# EAGLE design mini-v1.13-macrofab-rtg (EAGLE 7.2.0)

## Sheet 1 of 4: Main Microcontroller
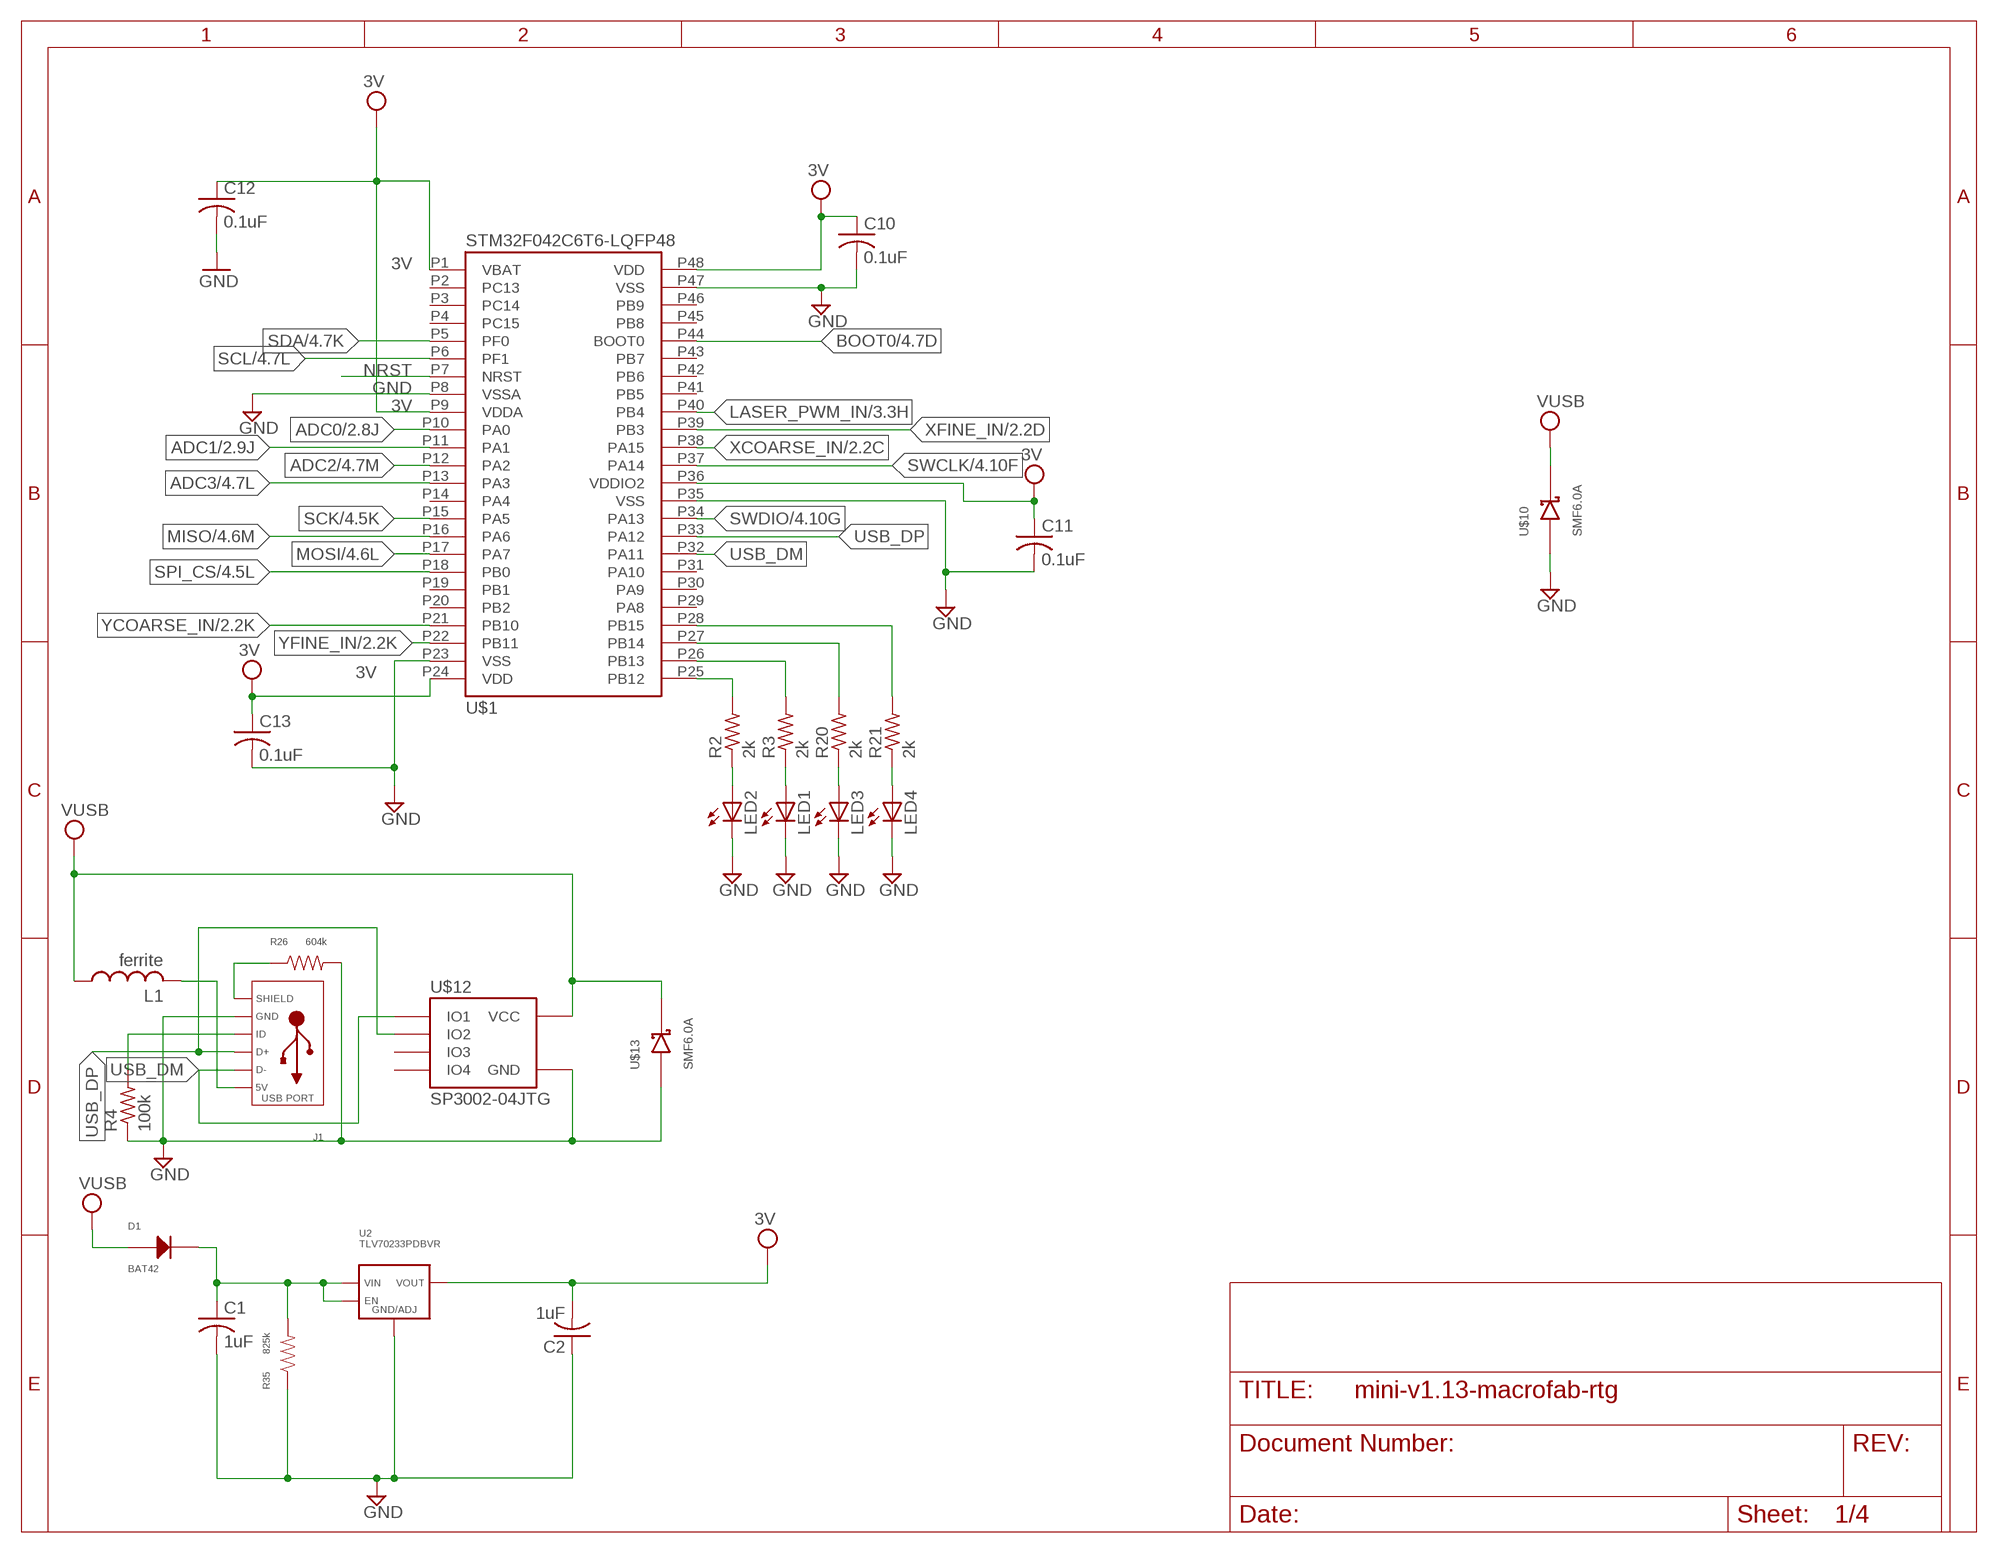
[diagram p0: schematic, sheet 1]

### Parts
C1  1uF  C-USC0603  [C0603]
C2  1uF  C-USC0603  [C0603]
C10  0.1uF  C-USC0603  [C0603]
C11  0.1uF  C-USC0603  [C0603]
C12  0.1uF  C-USC0603  [C0603]
C13  0.1uF  C-USC0603  [C0603]
D1  BAT42  DIODE_SOD-123  [SOD-123]
J1  USB_MICRO_RIGHT  [MICROUSB-RIGHT]
L1  ferrite  L-US  [C0603]
LED1  LEDCHIP-LED0603  [CHIP-LED0603]
LED2  LEDCHIP-LED0603  [CHIP-LED0603]
LED3  LEDCHIP-LED0603  [CHIP-LED0603]
LED4  LEDCHIP-LED0603  [CHIP-LED0603]
R2  2k  R-US_R0603  [R0603]
R3  2k  R-US_R0603  [R0603]
R4  100k  R-US_R0603  [R0603]
R20  2k  R-US_R0603  [R0603]
R21  2k  R-US_R0603  [R0603]
R26  604k  RESISTOR_0603  [R0603]
R35  825k  RESISTOR_0603  [R0603]
U2  TLV70233PDBVR  [SOT-23-5]
U$1  STM32F042C6T6-LQFP48  STM32F042-LQFP48  [LQFP48]
U$10  SMF6.0A  MBR0520  [SOD123]
U$12  SP3002-04JTG  SP3002  [SC70-6]
U$13  SMF6.0A  MBR0520  [SOD123]

### Nets
3V: C2.2 C10.1 C11.1 C12.1 C13.1 U2.P$5(VOUT) U$1.P1(VBAT) U$1.P9(VDDA) U$1.P24(VDD) U$1.P36(VDDIO2) U$1.P48(VDD) ; also sheet 2,4
ADC0: U$1.P10(PA0) ; also sheet 2
ADC1: U$1.P11(PA1) ; also sheet 2
ADC2: U$1.P12(PA2) ; also sheet 4
ADC3: U$1.P13(PA3) ; also sheet 4
BOOT0: U$1.P44(BOOT0) ; also sheet 4
GND [Power]: C1.2 C2.1 C10.2 C11.2 C12.2 C13.2 J1.5(GND) LED1.C LED2.C LED3.C LED4.C R4.1 R26.P$2 R35.P$1 U2.P$2(GND/ADJ) U$1.P8(VSSA) U$1.P23(VSS) U$1.P35(VSS) U$1.P47(VSS) U$10.ANODE U$12.P2(GND) U$13.ANODE ; also sheet 2,3,4
LASER_PWM_IN: U$1.P40(PB4) ; also sheet 3
MISO: U$1.P16(PA6) ; also sheet 4
MOSI: U$1.P17(PA7) ; also sheet 4
N$2: R2.2 U$1.P25(PB12)
N$3: LED2.A R2.1
N$4: C1.1 D1.CATHODE R35.P$2 U2.P$1(VIN) U2.P$3(EN)
N$5: J1.4(ID) R4.2
N$12: LED1.A R3.1
N$13: R3.2 U$1.P26(PB13)
N$14: J1.1(5V) L1.2
N$18: J1.S1(SLD) J1.S2(SLD) J1.S3(SLD) J1.S4(SLD) J1.S5(SLD) J1.S6(SLD) R26.P$1
N$24: LED3.A R20.1
N$27: LED4.A R21.1
N$28: R20.2 U$1.P27(PB14)
N$29: R21.2 U$1.P28(PB15)
NRST: U$1.P7(NRST) ; also sheet 4
SCK: U$1.P15(PA5) ; also sheet 4
SCL: U$1.P6(PF1) ; also sheet 4
SDA: U$1.P5(PF0) ; also sheet 4
SPI_CS: U$1.P18(PB0) ; also sheet 4
SWCLK: U$1.P37(PA14) ; also sheet 4
SWDIO: U$1.P34(PA13) ; also sheet 4
USB_DM: J1.2(D-) U$1.P32(PA11) U$12.P1(IO1)
USB_DP: J1.3(D+) U$1.P33(PA12) U$12.P3(IO2)
VUSB [Power]: D1.ANODE L1.1 U$10.CATHODE U$12.P5(VCC) U$13.CATHODE ; also sheet 2,3,4
XCOARSE_IN: U$1.P38(PA15) ; also sheet 2
XFINE_IN: U$1.P39(PB3) ; also sheet 2
YCOARSE_IN: U$1.P21(PB10) ; also sheet 2
YFINE_IN: U$1.P22(PB11) ; also sheet 2
Unconnected: U$1.P2(PC13) U$1.P3(PC14) U$1.P4(PC15) U$1.P14(PA4) U$1.P19(PB1) U$1.P20(PB2) U$1.P29(PA8) U$1.P30(PA9) U$1.P31(PA10) U$1.P41(PB5) U$1.P42(PB6) U$1.P43(PB7) U$1.P45(PB8) U$1.P46(PB9) U$12.P4(IO3) U$12.P6(IO4)

## Sheet 2 of 4: Dual PWM
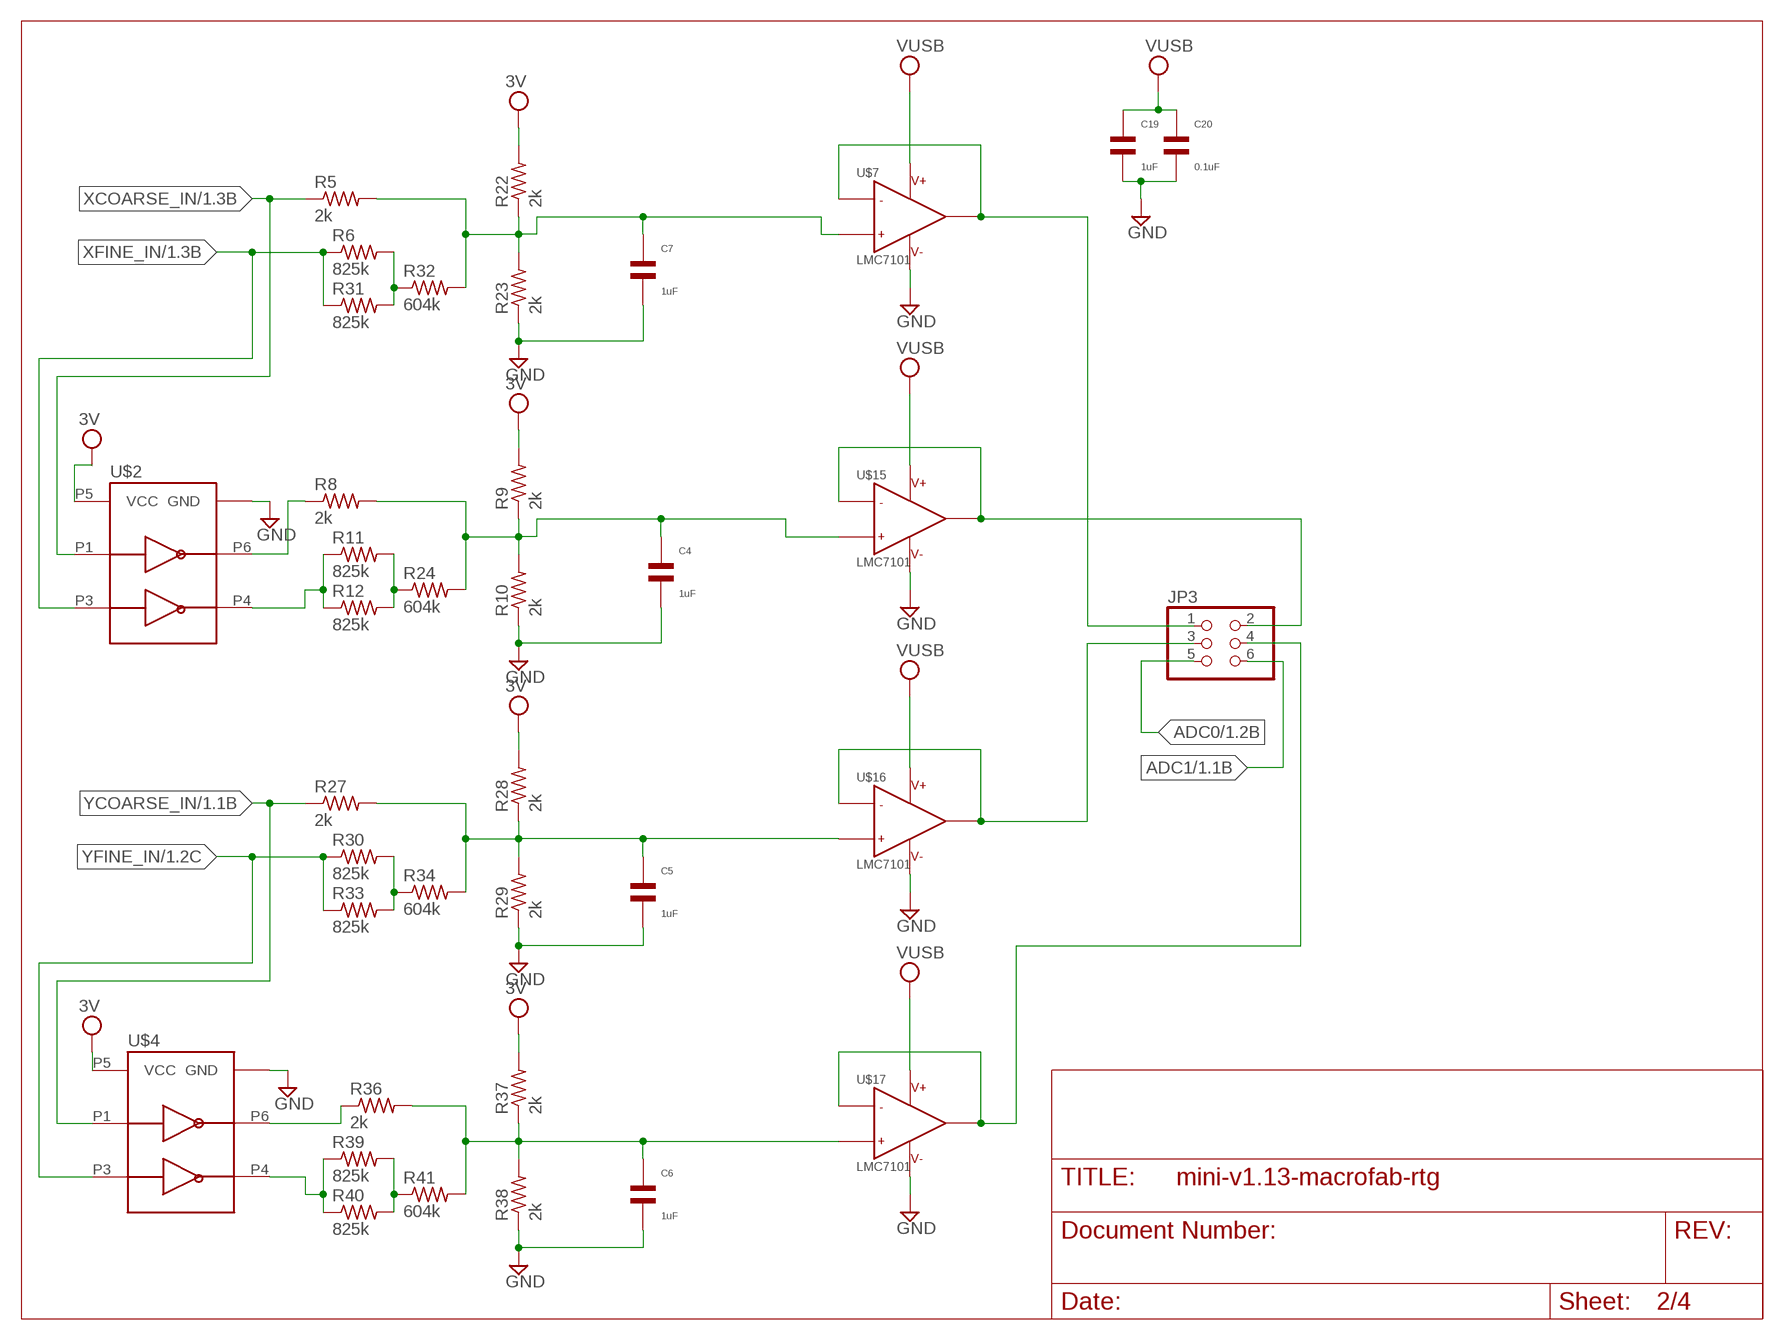
[diagram p1: schematic, sheet 2]

### Parts
C4  1uF  CAPACITOR_NP_0603  [C0603]
C5  1uF  CAPACITOR_NP_0603  [C0603]
C6  1uF  CAPACITOR_NP_0603  [C0603]
C7  1uF  CAPACITOR_NP_0603  [C0603]
C19  1uF  CAPACITOR_NP_0603  [C0603]
C20  0.1uF  CAPACITOR_NP_0603  [C0603]
JP3  PINHD-2X3  [2X03]
R5  2k  R-US_R0603  [R0603]
R6  825k  R-US_R0603  [R0603]
R8  2k  R-US_R0603  [R0603]
R9  2k  R-US_R0603  [R0603]
R10  2k  R-US_R0603  [R0603]
R11  825k  R-US_R0603  [R0603]
R12  825k  R-US_R0603  [R0603]
R22  2k  R-US_R0603  [R0603]
R23  2k  R-US_R0603  [R0603]
R24  604k  R-US_R0603  [R0603]
R27  2k  R-US_R0603  [R0603]
R28  2k  R-US_R0603  [R0603]
R29  2k  R-US_R0603  [R0603]
R30  825k  R-US_R0603  [R0603]
R31  825k  R-US_R0603  [R0603]
R32  604k  R-US_R0603  [R0603]
R33  825k  R-US_R0603  [R0603]
R34  604k  R-US_R0603  [R0603]
R36  2k  R-US_R0603  [R0603]
R37  2k  R-US_R0603  [R0603]
R38  2k  R-US_R0603  [R0603]
R39  825k  R-US_R0603  [R0603]
R40  825k  R-US_R0603  [R0603]
R41  604k  R-US_R0603  [R0603]
U$2  NC7WZ14P6X  [SC70-6]
U$4  NC7WZ14P6X  [SC70-6]
U$7  LMC7101  [SOT23-5]
U$15  LMC7101  [SOT23-5]
U$16  LMC7101  [SOT23-5]
U$17  LMC7101  [SOT23-5]

### Nets
3V: R9.2 R22.2 R28.2 R37.2 U$2.P5(VCC) U$4.P5(VCC) ; also sheet 1,4
ADC0: JP3.5 ; also sheet 1
ADC1: JP3.6 ; also sheet 1
COARSE1: R8.1 U$2.P6(Y1)
FINE1: R11.1 R12.1 U$2.P4(Y2)
FINE3: R39.1 R40.1 U$4.P4(Y2)
GND [Power]: C4.P$2 C5.P$2 C6.P$2 C7.P$2 C19.P$2 C20.P$2 R10.1 R23.1 R29.1 R38.1 U$2.P2(GND) U$4.P2(GND) U$7.5 U$15.5 U$16.5 U$17.5 ; also sheet 1,3,4
N$7: R36.1 U$4.P6(Y1)
N$8: R11.2 R12.2 R24.1
N$10: C4.P$1 R8.2 R9.1 R10.2 R24.2 U$15.3
N$30: R30.2 R33.2 R34.1
N$31: R6.2 R31.2 R32.1
N$32: C5.P$1 R27.2 R28.1 R29.2 R34.2 U$16.3
N$35: R39.2 R40.2 R41.1
N$36: C6.P$1 R36.2 R37.1 R38.2 R41.2 U$17.3
OUT: JP3.1 U$7.1 U$7.4
OUT1: JP3.2 U$15.1 U$15.4
OUT2: JP3.3 U$16.1 U$16.4
OUT3: JP3.4 U$17.1 U$17.4
VUSB [Power]: C19.P$1 C20.P$1 U$7.2 U$15.2 U$16.2 U$17.2 ; also sheet 1,3,4
XCOARSE_IN: R5.1 U$2.P1(A1) ; also sheet 1
XFINE_IN: R6.1 R31.1 U$2.P3(A2) ; also sheet 1
XSUM: C7.P$1 R5.2 R22.1 R23.2 R32.2 U$7.3
YCOARSE_IN: R27.1 U$4.P1(A1) ; also sheet 1
YFINE_IN: R30.1 R33.1 U$4.P3(A2) ; also sheet 1

## Sheet 3 of 4: Laser Power Driver
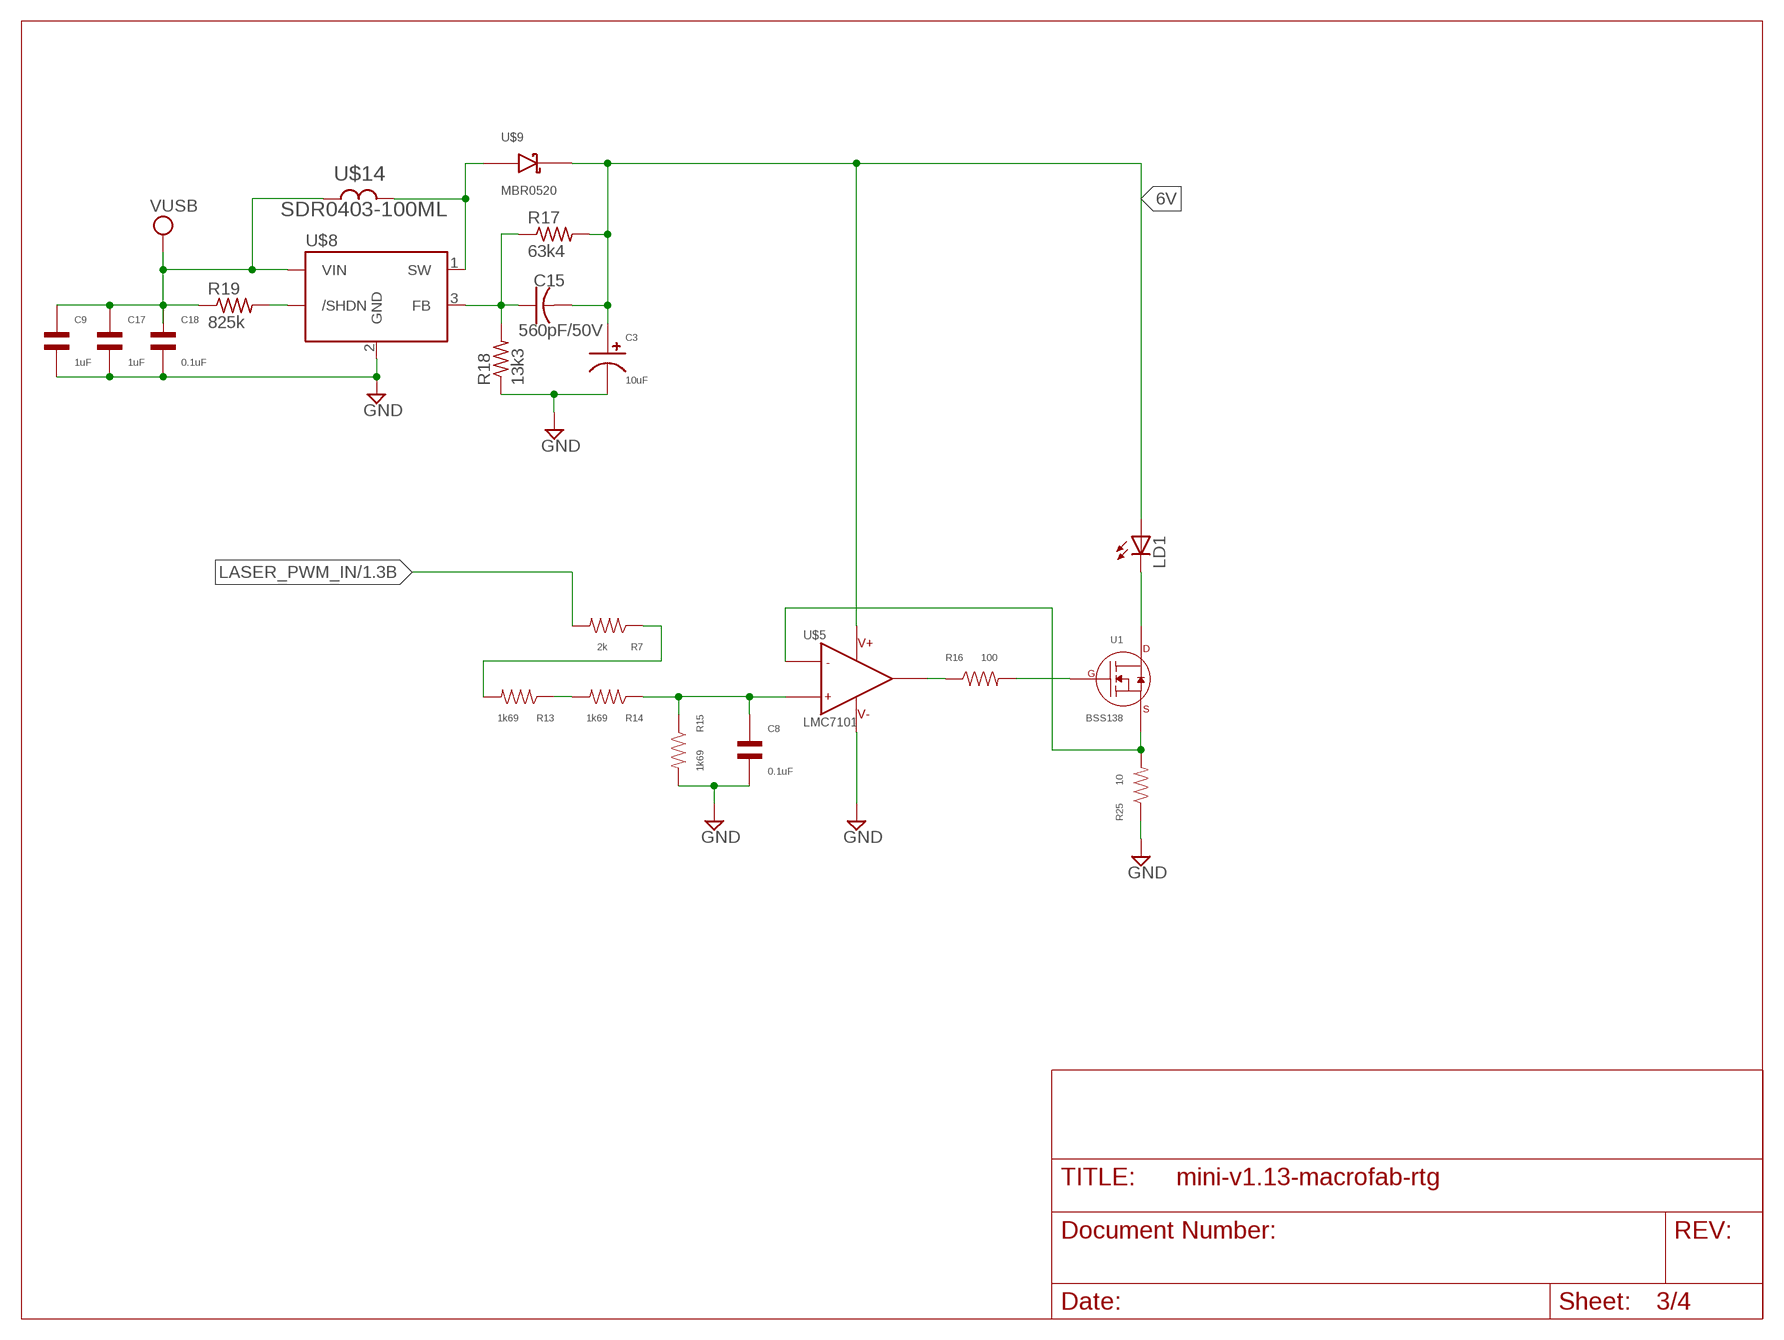
[diagram p2: schematic, sheet 3]

### Parts
C3  10uF  CAPACITOR_P_4MM  [CP4MM]
C8  0.1uF  CAPACITOR_NP_0603  [C0603]
C9  1uF  CAPACITOR_NP_0603  [C0603]
C15  560pF/50V  C-USC0603  [C0603]
C17  1uF  CAPACITOR_NP_0603  [C0603]
C18  0.1uF  CAPACITOR_NP_0603  [C0603]
LD1  LASERDIODELD2  [LASERDIODE2]
R7  2k  RESISTOR_0603  [R0603]
R13  1k69  RESISTOR_0603  [R0603]
R14  1k69  RESISTOR_0603  [R0603]
R15  1k69  RESISTOR_0603  [R0603]
R16  100  RESISTOR_0603  [R0603]
R17  63k4  R-US_R0603  [R0603]
R18  13k3  R-US_R0603  [R0603]
R19  825k  R-US_R0603  [R0603]
R25  10  RESISTOR_0603  [R0603]
U1  BSS138  N-CHANNEL_FET_SOT-23-3  [SOT-23-3]
U$5  LMC7101  OPAMP-SINGLELMC7101  [SOT23-5]
U$8  LMR62014  [SOT23-5]
U$9  MBR0520  [SOD123]
U$14  SDR0403-100ML  SDR0403  [SDR0403]

### Nets
6V [Power]: C3.P$1 C15.2 LD1.P$1(A) R17.2 U$5.2(V+) U$9.CATHODE
GND [Power]: C3.P$2 C8.P$2 C9.P$2 C17.P$2 C18.P$2 R15.P$2 R18.1 R25.P$1 U$5.5(V-) U$8.2(GND) ; also sheet 1,2,4
LASER_PWM_IN: R7.P$2 ; also sheet 1
N$6: R7.P$1 R13.P$2
N$9: R13.P$1 R14.P$2
N$11: C8.P$1 R14.P$1 R15.P$1 U$5.3(IN+)
N$15: U$8.1(SW) U$9.ANODE U$14.P$2
N$16 [Power]: LD1.P$3(C) U1.P$3(DRAIN)
N$17 [Power]: R25.P$2 U1.P$2(SOURCE) U$5.4(IN-)
N$19 [Power]: R16.P$2 U1.P$1(GATE)
N$20: R16.P$1 U$5.1(OUT)
N$25: C15.1 R17.1 R18.2 U$8.3(FB)
N$26: R19.2 U$8.4(/SHDN)
VUSB [Power]: C9.P$1 C17.P$1 C18.P$1 R19.1 U$8.5(VIN) U$14.P$1 ; also sheet 1,2,4

## Sheet 4 of 4
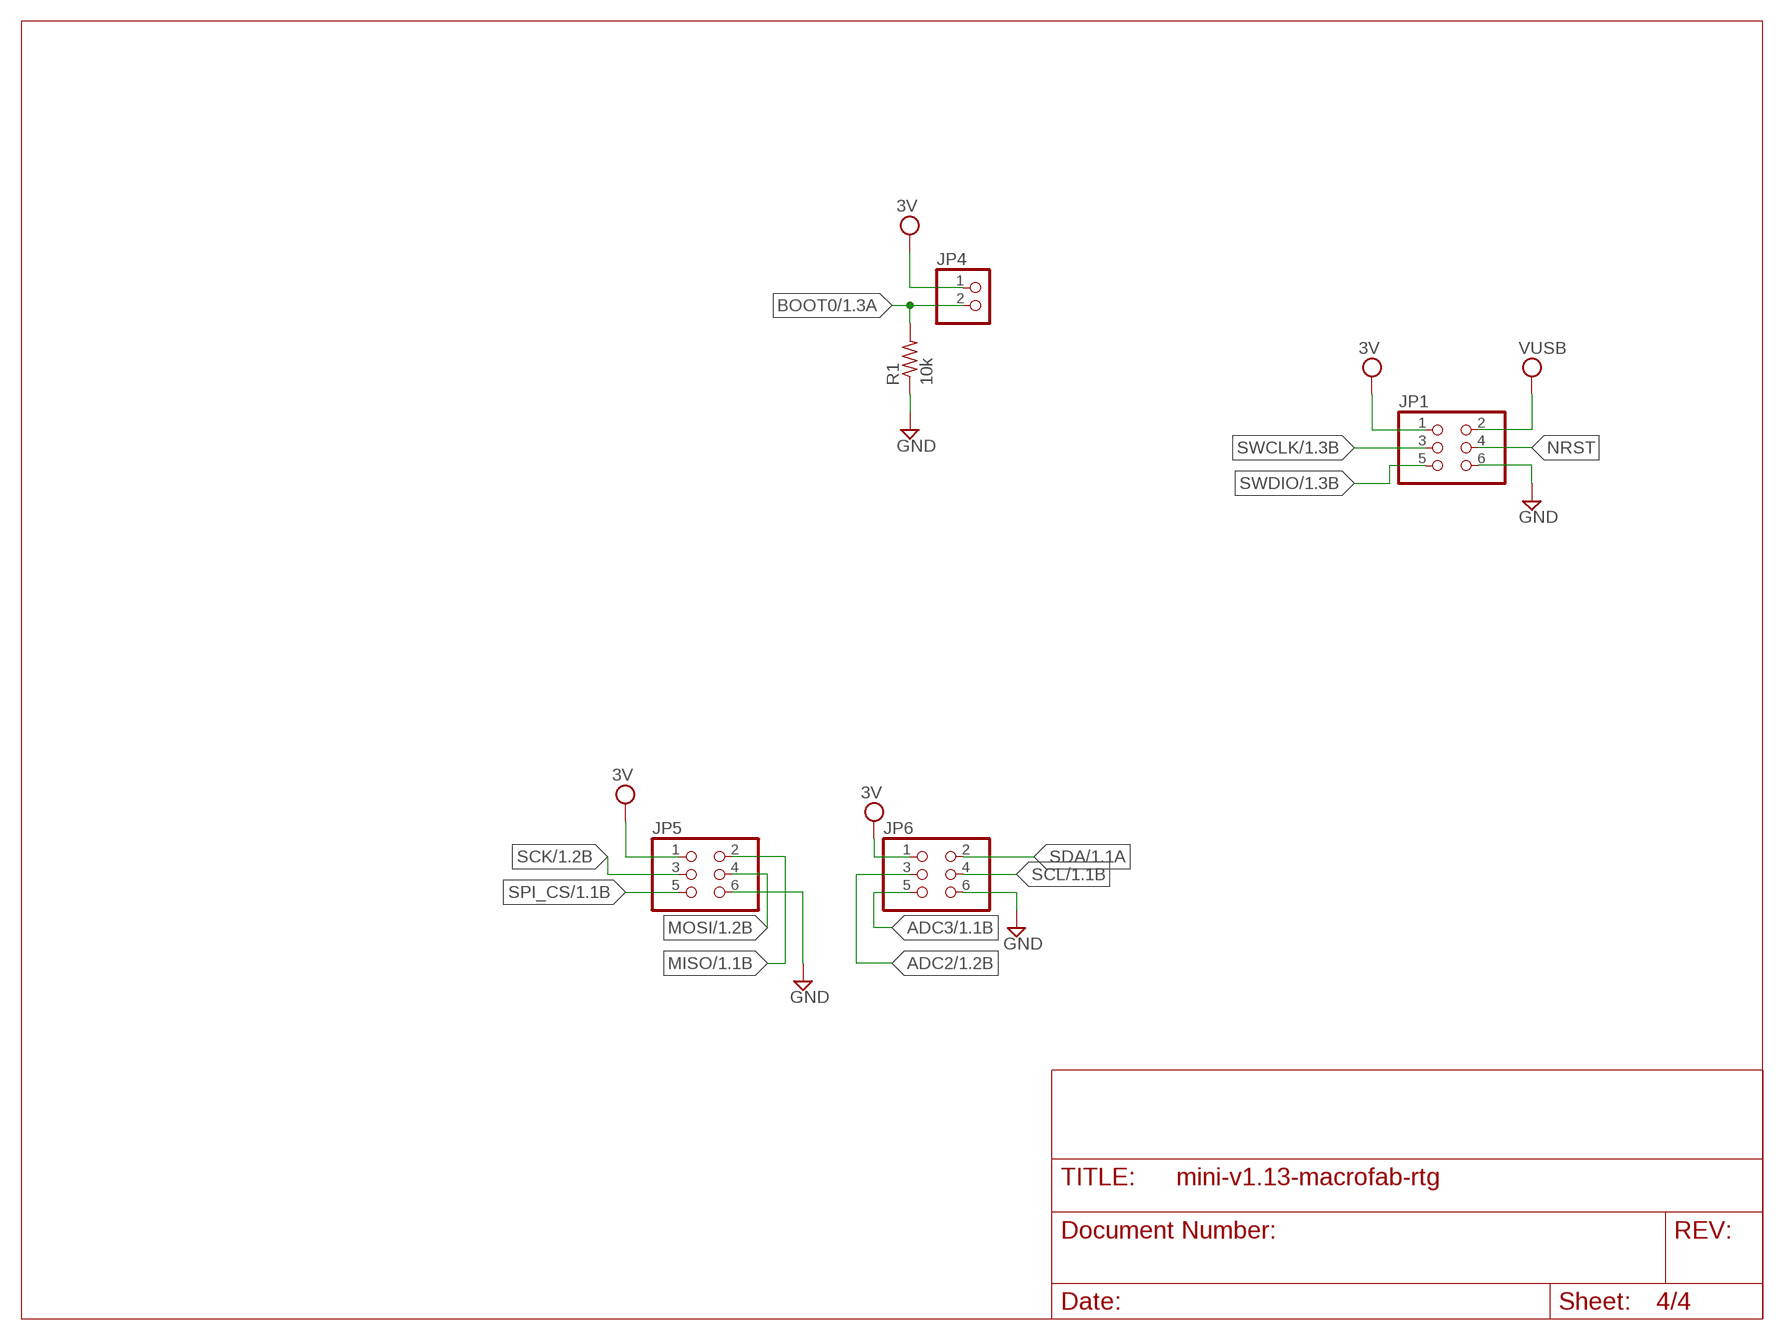
[diagram p3: schematic, sheet 4]

### Parts
JP1  PINHD-2X3  [2X03]
JP4  PINHD-1X2  [1X02]
JP5  PINHD-2X3  [2X03]
JP6  PINHD-2X3  [2X03]
R1  10k  R-US_R0603  [R0603]

### Nets
3V: JP1.1 JP4.1 JP5.1 JP6.1 ; also sheet 1,2
ADC2: JP6.3 ; also sheet 1
ADC3: JP6.5 ; also sheet 1
BOOT0: JP4.2 R1.2 ; also sheet 1
GND [Power]: JP1.6 JP5.6 JP6.6 R1.1 ; also sheet 1,2,3
MISO: JP5.2 ; also sheet 1
MOSI: JP5.4 ; also sheet 1
NRST: JP1.4 ; also sheet 1
SCK: JP5.3 ; also sheet 1
SCL: JP6.4 ; also sheet 1
SDA: JP6.2 ; also sheet 1
SPI_CS: JP5.5 ; also sheet 1
SWCLK: JP1.3 ; also sheet 1
SWDIO: JP1.5 ; also sheet 1
VUSB [Power]: JP1.2 ; also sheet 1,2,3

## Library data of the parts
C1 C2 C10-C13 C15 = rcl:C-US: CAPACITOR, American symbol
C3 = MF_Passives:CAPACITOR_P: Library: MF_Passives Description: Device for Polarized Capacitors. Manufacture part number (MFG#), Voltage Rating, and Tolerance can be added via Attributes.; MFG#: N/A; TOLERANCE: N/A; VOLTAGE: N/A
C4-C9 C17-C20 = MF_Passives:CAPACITOR_NP: Library: MF_Passives Description: Device for Non-Polarized Capacitors. Manufacture part number (MFG#), Voltage, Temperature Coefficient, and Tolerance can be added via Attributes.; MFG#: N/A; TEMP_COF: N/A; TOLERANCE: N/A; VOLTAGE: N/A
D1 = MF_Discrete_Semiconductor:DIODE: Library: MF_Discrete_Semiconductor Description: Device for Single Packaged Diodes. Manufacture part number (MFG#) can be added via Attributes.; MFG#: N/A
J1 = MF_Connectors:USB: Library: MF_Connectors Description: 5 Pin USB Connectors. SLD is the shield connection. Usually tied to ground through a small ferrite bead.
JP1 JP3 JP5 JP6 = pinhead:PINHD-2X3: PIN HEADER
JP4 = pinhead:PINHD-1X2: PIN HEADER
L1 = lmdparts:L-US: INDUCTOR, American symbol
LD1 = Scott:LASERDIODE; MPN: 3 x (0552-2-15-15-11-27-10-0)
LED1-LED4 = adafruit:LED: LED OSRAM: - CHIPLED LG R971, LG N971, LY N971, LG Q971, LY Q971, LO R971, LY R971 LH N974, LH R974 LS Q976, LO Q976, LY Q976 LO Q996 - Hyper CHIPLED LW Q18S LB Q993, LB Q99A, LB R99A - SideLED LS A670, LO A670, LY A670, LG A670, LP A670 LB A673, LV A673, LT A673, LW A673 LH A674 LY A675 LS A676, LA A676, LO A676, LY A676, LW A676 LS A679, LY A679, LG A679 - Hyper Micro SIDELED® LS Y876, LA Y876, LO Y876, LY Y876 LT Y87S - SmartLED LW L88C, LW L88S LB L89C, LB L89S, LG L890 LS L89K, LO L89K, LY L89K LS L896, LA L896, LO L896, LY L896 - TOPLED LS T670, LO T670, LY T670, LG T670, LP T670 LSG T670, LSP T670, LSY T670, LOP T670, LYG T670 LG T671, LOG T671, LSG T671 LB T673, LV T673, LT T673, LW T673 LH T674 LS T676, LA T676, LO T676, LY T676, LB T676, LH T676, LSB T676, LW T676 LB T67C, LV T67C, LT T67C, LS T67K, LO T67K, LY T67K, LW E67C LS E67B, LA E67B, LO E67B, LY E67B, LB E67C, LV E67C, LT E67C LW T67C LS T679, LY T679, LG T679 LS T770, LO T770, LY T770, LG T770, LP T770 LB T773, LV T773, LT T773, LW T773 LH T774 LS E675, LA E675, LY E675, LS T675 LS T776, LA T776, LO T776, LY T776, LB T776 LHGB T686 LT T68C, LB T68C - Hyper Mini TOPLED® LB M676 - Mini TOPLED Santana® LG M470 LS M47K, LO M47K, LY M47K Source: http://www.osram.convergy.de/
R1-R6 R8-R12 R17-R24 R27-R34 R36-R41 = rcl:R-US_: RESISTOR, American symbol
R7 R13-R16 R25 R26 R35 = MF_Passives:RESISTOR: Library: MF_Passives Description: Device for Resistors. Manufacture part number (MFG#), Voltage, Tolerance, and Wattage Rating can be added via Attributes.; MFG#: N/A; TOLERANCE: N/A; VOLTAGE: N/A; WATTAGE: N/A
U1 = MF_Discrete_Semiconductor:N-CHANNEL_FET: Library: MF_Discrete_Semiconductor Description: Device for Single N-Channel Mosfet. Manufacture part number (MFG#) can be added via Attributes.
U2 = MF_IC_Power:TLV702: Manufacturer Part #: TLV702 Manufacturer: Texas Instruments Description: LDO Voltage Regulators
U$1 = lmdparts:STM32F042-LQFP48
U$2 U$4 = lmdparts:NC7WZ14P6X: 2-circuit logic inverter, ultra-high-speed and cheap
U$5 = lmdparts:OPAMP-SINGLE: Single amp opamps
U$7 U$15-U$17 = lmdparts:LMC7101
U$8 = lmdparts:LMR62014
U$9 U$10 U$13 = lmdparts:MBR0520
U$12 = lmdparts:SP3002
U$14 = lmdparts:SDR0403

## Net classes
1 Power: width 0.305 mm

## Board
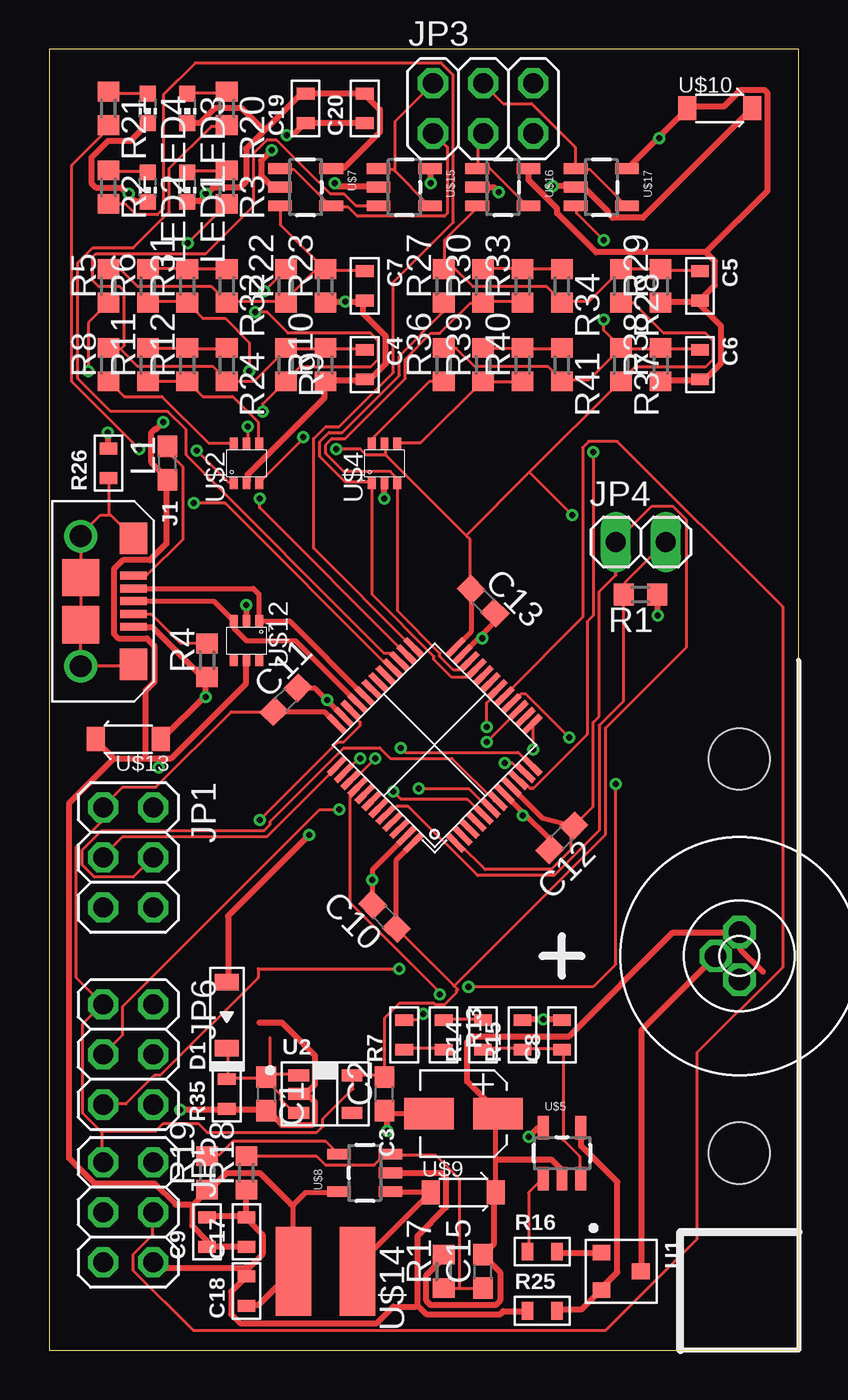
[diagram p4: board, top side]
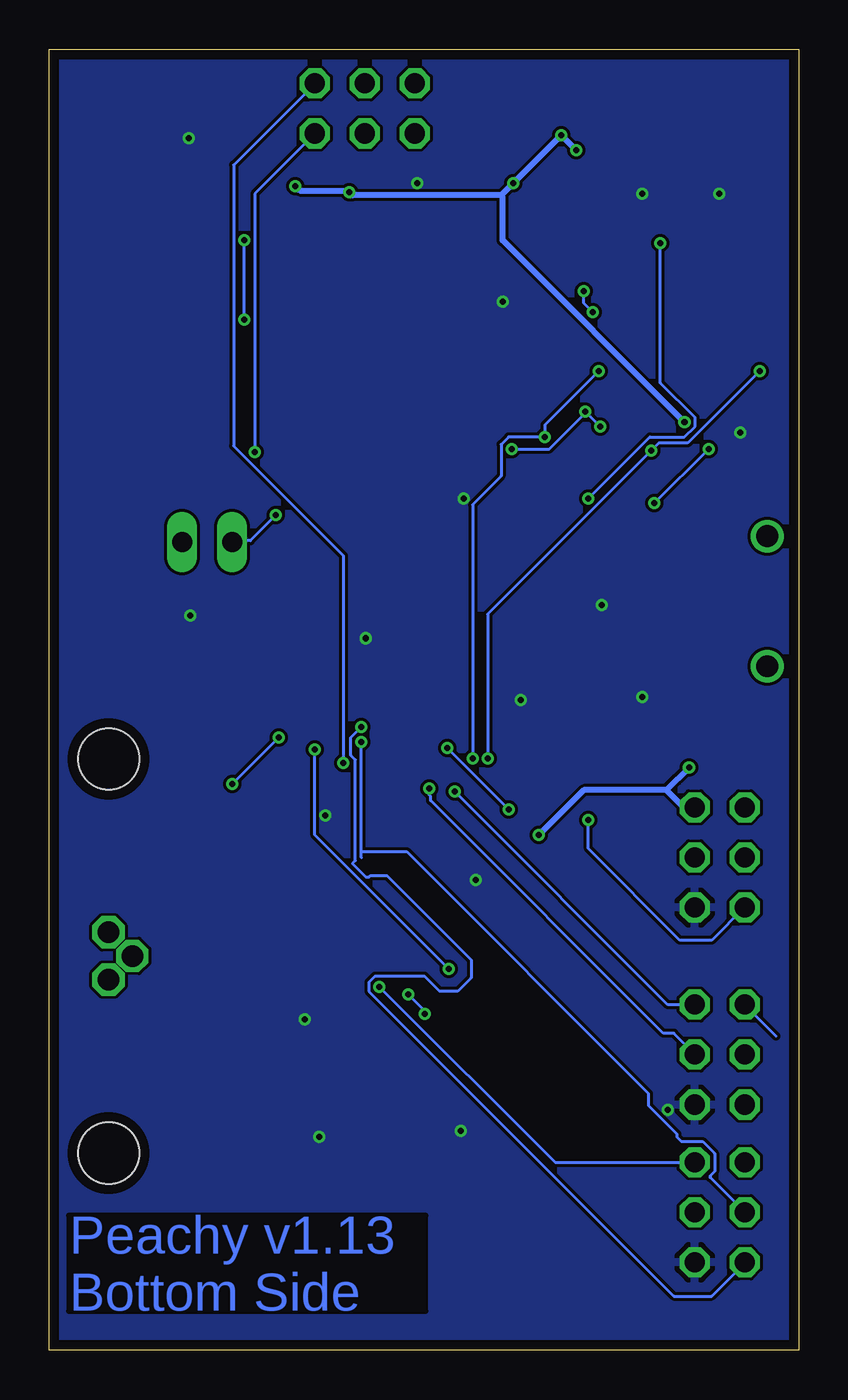
[diagram p5: board, bottom side, seen from below]

Size 38.01 x 66 mm. Coordinates in mm from the lower left corner, seen from the top.
Outline: 0,0 38.01,0 38,66 0,66 0,0
Copper layers (1*16): Top 0.035mm / dielectric 1.5mm / Bottom 0.035mm
Design rules "SeeedStudio_2layer_DRU_no_angle_20140221 *": minimum track width 6mil, minimum drill 12mil, track to track 6mil, track to pad 6mil, pad to pad 6mil, via to via 6mil, smd to smd 0mil, copper to edge 20mil, drill to drill 10mil, minimum pad ring 10mil, minimum via ring 6mil, stop-mask expansion 2mil, vias tented up to drill 100mil, thermal gap 10mil
Holes 3.1 mm at 35,10 35,30

### Footprints (pad centres in the part's own frame; a part is rotated, then mirrored left to right if it is on the bottom)
C0603 = smd 1.1 x 1: 1 -0.85,0; 2 0.85,0
CP4MM = smd 1.6 x 2.5: P$1 0,-1.75; P$2 0,1.75
C0603' = smd 0.6 x 0.9: P$1 -0.75,0; P$2 0.75,0
SOD-123 = smd 0.85 x 1.2: ANODE 1.675,0; CATHODE -1.675,0
MICROUSB-RIGHT = smd 0.4 x 1.35: 1 -1.3,1.27; 2 -0.65,1.27; 3 0,1.27; 4 0.65,1.27; 5 1.3,1.27 | drill 1.1: S1 -3.3,-1.405; S2 3.3,-1.405 | smd 1.6 x 1.4: S3 -3.2,1.27; S4 3.2,1.27 | smd 1.9 x 1.9: S5 -1.2,-1.405; S6 1.2,-1.405
2X03 = drill 1.016 octagon: 1 -2.54,-1.27; 2 -2.54,1.27; 3 0,-1.27; 4 0,1.27; 5 2.54,-1.27; 6 2.54,1.27
1X02 = drill 1.016 long: 1 -1.27,0; 2 1.27,0
LASERDIODE2 = drill 1.092 pad 1.499 octagon: P$1 0,1.203; P$2 0,-1.203; P$3 -1.203,0
CHIP-LED0603 = smd 0.8 x 0.8: A 0,-0.75; C 0,0.75
R0603 = smd 1 x 1.1: 1 -0.85,0; 2 0.85,0
R0603' = smd 0.6 x 0.9: P$1 -0.75,0; P$2 0.75,0
SOT-23-3 = smd 0.8 x 0.9: P$1 -0.95,-1; P$2 0.95,-1; P$3 0,1
SOT-23-5 = smd 1.05 x 0.6: P$1 -1.35,0.95; P$2 -1.35,0; P$3 -1.35,-0.95; P$4 1.35,-0.95; P$5 1.35,0.95
LQFP48 = smd 0.3 x 1.2: P1 -2.75,-0.6; P2 -2.25,-0.6; P3 -1.75,-0.6; P4 -1.25,-0.6; P5 -0.75,-0.6; P6 -0.25,-0.6; P7 0.25,-0.6; P8 0.75,-0.6; P9 1.25,-0.6; P10 1.75,-0.6; P11 2.25,-0.6; P12 2.75,-0.6; P25 2.75,7.9; P26 2.25,7.9; P27 1.75,7.9; P28 1.25,7.9; P29 0.75,7.9; P30 0.25,7.9; P31 -0.25,7.9; P32 -0.75,7.9; P33 -1.25,7.9; P34 -1.75,7.9; P35 -2.25,7.9; P36 -2.75,7.9 | smd 1.2 x 0.3: P13 4.25,0.9; P14 4.25,1.4; P15 4.25,1.9; P16 4.25,2.4; P17 4.25,2.9; P18 4.25,3.4; P19 4.25,3.9; P20 4.25,4.4; P21 4.25,4.9; P22 4.25,5.4; P23 4.25,5.9; P24 4.25,6.4; P37 -4.25,6.4; P38 -4.25,5.9; P39 -4.25,5.4; P40 -4.25,4.9; P41 -4.25,4.4; P42 -4.25,3.9; P43 -4.25,3.4; P44 -4.25,2.9; P45 -4.25,2.4; P46 -4.25,1.9; P47 -4.25,1.4; P48 -4.25,0.9
SC70-6 = smd 0.4 x 0.6: P1 -0.65,-1; P2 0,-1; P3 0.65,-1; P4 0.65,1; P5 0,1; P6 -0.65,1
SOT23-5 = smd 0.55 x 1.2: 1 -0.95,-1.3; 2 0,-1.3; 3 0.95,-1.3; 4 0.95,1.3; 5 -0.95,1.3
SOD123 = smd 0.91 x 1.22: ANODE -1.65,0; CATHODE 1.65,0
SDR0403 = smd 4.5 x 1.8: P$1 0,1.625; P$2 0,-1.625

### Placement (x,y rotation side)
C1  11,13 270 top
C2  17,13 90 top
C3  21,12 90 top
C4  1uF  [C0603']  16,50 270 top
C5  1uF  [C0603']  33,54 270 top
C6  1uF  [C0603']  33,50 270 top
C7  1uF  [C0603']  16,54 270 top
C8  0.1uF  [C0603']  26,16 90 top
C9  1uF  [C0603']  8,6 90 top
C10  17,22 135 top
C11  12,33 45 top
C12  26,26 225 top
C13  22,38 315 top
C15  22,4 90 top
C17  1uF  [C0603']  10,6 90 top
C18  0.1uF  [C0603']  10,3 90 top
C19  1uF  [C0603']  13,63 90 top
C20  0.1uF  [C0603']  16,63 90 top
D1  9,17 90 top
J1  3,38 270 top
JP1  4,25 270 top
JP3  22,63 0 top
JP4  30,41 0 top
JP5  4,7 270 top
JP6  4,15 270 top
L1  6,45 90 top
LD1  35,20 0 top
LED1  7,59 180 top
LED2  5,59 180 top
LED3  7,63 180 top
LED4  5,63 180 top
R1  29.98,38.34 180 top
R2  3,59 270 top
R3  9,59 270 top
R4  8,35 90 top
R5  3,54 90 top
R6  5,54 90 top
R7  2k  [R0603']  18,16 90 top
R8  3,50 90 top
R9  12,50 270 top
R10  14,50 90 top
R11  5,50 90 top
R12  7,50 90 top
R13  1k69  [R0603']  20,16 270 top
R14  1k69  [R0603']  22,16 90 top
R15  1k69  [R0603']  24,16 90 top
R16  100  [R0603']  25,5 0 top
R17  20,4 90 top
R18  10,9 90 top
R19  8,9 90 top
R20  9,63 270 top
R21  3,63 270 top
R22  12,54 90 top
R23  14,54 90 top
R24  9,50 270 top
R25  10  [R0603']  25,2 0 top
R26  604k  [R0603']  3,45 90 top
R27  20,54 90 top
R28  29,54 270 top
R29  31,54 90 top
R30  22,54 90 top
R31  7,54 90 top
R32  9,54 270 top
R33  24,54 90 top
R34  26,54 270 top
R35  825k  [R0603']  9,13 90 top
R36  20,50 90 top
R37  29,50 270 top
R38  31,50 90 top
R39  22,50 90 top
R40  24,50 90 top
R41  26,50 270 top
U1  29,4 270 top
U2  14,13 0 top
U$1  22.12,28.12 45 top
U$2  10,45 0 top
U$4  17,45 0 top
U$5  26,10 0 top
U$7  13,59 270 top
U$8  16,9 90 top
U$9  21,8 0 top
U$10  34,63 0 top
U$12  10,36 180 top
U$13  4,31 180 top
U$14  14,4 90 top
U$15  18,59 270 top
U$16  23,59 270 top
U$17  28,59 270 top

### Tracks (layer width: path | path; a pad name or v marks a point on that pad's centre or on a via)
3V  (via drill 0.3)
  Top 0.152: C11.1 11.28,32.38 9.22,32.38 5.41,28.57 3.73,28.57 2.74,27.58 JP1.1 2.67,27.51 2.67,26.82 1.37,25.53 1.37,18.9 2.67,17.6 JP6.1 2.67,17.53 1.68,16.54 1.68,12.04 2.63,11.09 | 20.54,18.48 17.68,21.34 C10.1 | 20.54,18.48 20.69,18.33 | 20.69,18.33 20.73,18.29 | U$1.P1 20.65,25.68 20.8,25.68 22.1,24.38 25.45,24.38 26.44,25.38 26.44,26.52 C12.1 27.58,27.58 27.58,31.85 27.89,32.16 27.89,38.48 28.73,39.32 JP4.1 28.8,41.07 30.56,42.82 31.62,42.82 32.31,42.14 32.31,35.66 28.19,31.55 28.19,26.14 20.54,18.48 | v10.06,46.86 10.06,46.02 U$2.P5 | v10.82,47.62 10.82,48.01 11.96,49.15 R9.2 12.04,49.23 12.72,49.91 16.31,49.91 16.69,50.29 16.69,51.21 16.31,51.59 12.12,51.59 11.05,52.65 v10.44,52.65 | v10.9,53.72 11.96,54.79 R22.2 | 17.07,45.41 17.07,45.95 U$4.P5 | 21.14,41.34 21.34,41.15 21.34,38.71 C13.1 | 21.14,41.34 17.07,45.41 | 21.14,41.34 24.35,44.54 | 24.35,44.54 28.96,49.15 R37.2 29.03,49.23 29.72,49.91 33.3,49.91 33.68,50.29 33.68,51.21 33.3,51.59 31.17,51.59 29.64,53.11 29.03,53.11 R28.2 | v14.55,45.72 15.77,45.72 16.08,45.41 17.07,45.41 | 24.35,44.54 v26.52,42.37 | 20.69,18.33 20.65,18.29 20.65,18.14 20.04,17.53 19.58,17.53 19.51,17.6 17.75,17.6 16.99,16.84 16.99,13.95 C2.2 16.99,13.87 16.92,13.95 15.39,13.95 U2.P$5 15.39,13.87 15.39,13.26 13.87,11.73 13.87,11.35 13.56,11.05 8,11.05 7.54,11.51 5.79,11.51 5.41,11.12 2.67,11.12 2.63,11.09 | 2.63,11.09 2.67,11.05 2.67,9.6 JP5.1
  Top 0.254: U$1.P9 25,27 C12.1 | C10.1 17.6,24.87 U$1.P48 | C11.1 13.96,32.4 U$1.P36 | C13.1 21.4,36.45 U$1.P24
  Bottom 0.152: 1.14,15.93 2.74,17.53 JP6.1 | v10.06,46.86 v10.82,47.62 10.82,47.55 12.65,45.72 v14.55,45.72 | v10.9,53.72 10.9,53.11 v10.44,52.65 | v26.52,42.37 27.81,41.07 28.73,41.07 JP4.1
6V
  Top 0.254: U$9.CATHODE 22.65,9.68 22.65,11.9 C3.P$1
  Top 0.305: 36.2,19.2 35.05,20.34 35.05,21.18 LD1.P$1 34.9,21.18 31.62,21.18 26.36,15.93 21.49,15.93 21.18,15.62 21.18,13.64 22.71,12.12 C3.P$1 | 22.65,9.68 25.45,9.68 25.98,9.14 25.98,8.76 U$5.2 | R17.2 19.96,4.8 19.96,4.65 19.13,3.81 19.13,2.52 19.36,2.29 22.63,2.29 22.86,2.52 22.86,3.96 22.02,4.8 C15.2 22.1,4.95 22.55,5.41 22.55,7.92 U$9.CATHODE
ADC0  (via drill 0.3)
  Top 0.152: v27.58,45.57 27.58,37.26 27.28,36.96 27.28,31.24 24.54,28.5 24.38,28.5 24,28.88 23.85,28.88 U$1.P10
  Bottom 0.152: v27.58,45.57 27.58,58.67 JP3.5
ADC1  (via drill 0.3)
  Top 0.152: v23.09,29.79 23.47,29.79 23.93,29.34 24.08,29.34 U$1.P11
  Bottom 0.152: v23.09,29.79 23.09,40.31 28.65,45.87 28.65,60.12 24.54,64.24 JP3.6
ADC2  (via drill 0.3)
  Top 0.152: v17.83,30.56 18.06,30.33 23.77,30.33 24.46,29.64 U$1.P12 | v14.71,27.43 13.72,27.43 3.73,17.45 3.73,16 2.74,15.01 JP6.3
  Bottom 0.152: v14.71,27.43 v17.83,30.56
ADC3  (via drill 0.3)
  Top 0.152: v24.54,30.48 24.54,31.7 U$1.P13 | v17.75,19.36 10.59,19.36 10.59,18.9 5.64,13.95 5.33,13.95 3.89,12.5 2.74,12.5 JP6.5
  Bottom 0.152: v24.54,30.48 24.54,26.14 v17.75,19.36
BOOT0
  Top 0.152: JP4.2 31.24,41 29.18,38.94 29.18,38.41 R1.2 29.11,38.33 29.11,32.92 27.89,31.7 27.89,26.36 25.6,24.08 21.72,24.08 18.21,27.58 17.6,27.58 17.22,27.2 17.07,27.2 U$1.P44
COARSE1
  Top 0.152: U$2.P6 9.3,46.02 8.08,46.02 5.71,48.39 3.81,48.39 3.05,49.15 R8.1
FINE1
  Top 0.152: U$2.P4 10.59,46.02 10.59,47.09 9.3,48.39 7.77,48.39 R12.1 6.93,49.15 5.03,49.15 R11.1
FINE3
  Top 0.152: U$4.P4 17.68,46.02 18.82,46.02 21.95,49.15 R39.1 22.02,49.15 23.93,49.15 R40.1
GND  (via drill 0.3)
  Top 0.254: C12.2 25.4,25.9 24.09,27.21 U$1.P8 | C10.2 16.4,23.85 16.4,24.38 U$1.P47 | C11.2 13.46,33.6 14.08,32.98 U$1.P35 | C13.2 22.6,36.95 21.86,36.2 U$1.P23 | C3.P$2 17.15,12 C2.1
  Top 0.305: 30.9,61.53 32.31,62.94 U$10.ANODE 32.46,63.09 34.21,63.09 35.05,63.93 36.27,63.93 36.42,63.78 36.42,58.83 33.3,55.7 | 30.9,61.53 29.34,59.97 U$17.5 | R38.1 31.01,49.23 32.99,49.23 C6.P$2 33.15,49.3 33.3,49.3 34.06,50.06 34.06,51.97 32.99,53.03 C5.P$2 | C5.P$2 32.99,53.19 31.01,53.19 R29.1 | 33.3,55.7 27.74,55.7 25.76,57.68 25.76,57.91 24.31,59.36 24.31,59.89 U$16.5 | 33.3,55.7 33.76,55.24 33.76,54.03 33.07,53.34 C5.P$2 | R23.1 14.02,53.19 v15.01,53.19 15.93,53.19 C7.P$2 15.93,53.03 15.93,52.58 17.07,51.44 17.07,50.06 16.23,49.23 16.15,49.23 C4.P$2 15.93,49.23 14.1,49.23 R10.1 13.95,49.15 13.95,48.31 10.06,44.42 10.06,44.04 U$2.P2 | 7.96,58.64 8.31,58.98 9.68,58.98 9.98,59.28 9.98,60.96 10.9,61.87 | 7.96,58.64 7.62,58.29 7.01,58.29 LED1.C | 10.9,61.87 12.72,63.7 12.95,63.7 C19.P$2 13.11,63.78 15.93,63.78 C20.P$2 16.08,63.63 16.76,62.94 16.76,61.8 14.94,59.97 14.33,59.97 U$7.5 | 10.9,61.87 9.75,63.02 8.38,63.02 7.62,62.26 LED3.C | 10.67,16.61 11.81,16.61 13.49,14.94 13.49,13.49 13.03,13.03 12.72,13.03 U2.P$2 13.11,12.95 13.49,12.57 13.49,11.58 13.34,11.43 11.81,11.43 11.12,12.12 C1.2 10.97,12.19 9.07,12.19 R35.P$1 8.91,12.19 v6.63,12.19 | 7.92,33.22 7.92,34.14 R4.1 7.77,34.14 5.26,36.65 4.34,36.65 J1.5 | 7.92,33.22 5.71,31.01 U$13.ANODE | 4,58.64 3.66,58.98 2.36,58.98 2.13,59.21 2.13,60.5 2.97,61.34 4.12,61.34 4.95,62.18 LED4.C | 4,58.64 4.34,58.29 4.95,58.29 LED2.C | R15.P$2 24.06,16.77 v25.05,16.77 25.96,16.77 C8.P$2 | v9.98,37.8 9.98,37.03 U$12.P2 | v16.99,43.2 16.99,43.97 U$4.P2 | v2.97,46.56 2.97,45.8 R26.P$2 | v30.86,37.26 30.86,38.33 R1.1
  Top 0.305: v19.36,59.21 19.36,59.89 U$15.5 | v21.95,36.12 21.86,36.2 | v14.1,32.99 14.08,32.98 | v24,27.13 24.09,27.21 | v16.38,23.85 16.4,23.85 | v4.04,58.67 4,58.64 | v7.92,33.15 7.92,33.22 | v7.92,58.67 7.96,58.64 | v30.94,61.49 30.9,61.53 | 18.67,2.29 19.13,1.83 22.86,1.83 23.01,1.98 24.23,1.98 R25.P$1 | 18.67,2.29 18.67,5.79 20.12,7.24 20.12,8.76 19.89,8.99 17.37,8.99 U$8.2 | C9.P$2 8,6.78 9.98,6.78 C17.P$2 | 10.06,4.12 10.06,3.81 C18.P$2 9.91,3.66 9.22,2.97 9.22,1.83 9.68,1.37 16.61,1.37 17.45,2.21 18.59,2.21 18.67,2.29 | 10.06,4.12 10.82,4.88 10.82,5.87 10.06,6.63 C17.P$2 | R18.1 9.98,8.08 9.98,6.93 C17.P$2 | v24.31,10.82 24.77,11.28 24.99,11.28 U$5.5 | v17.14,11.12 17.14,11.89 C2.1 | 10.06,4.12 9.98,4.19 5.56,4.19 5.33,4.42 JP5.6
  pour Bottom: 0,0 38,0 38,66 0,66
LASER_PWM_IN  (via drill 0.3)
  Top 0.152: 19.85,18.1 15.24,22.71 15.24,28.19 15.62,28.57 U$1.P40 | 19.85,18.1 19.96,17.98 | 17.96,16.77 R7.P$2 18.06,16.76 18.67,16.76 v18.97,17.07 | v19.81,18.06 19.85,18.1
  Bottom 0.152: v18.97,17.07 18.97,17.22 v19.81,18.06
MISO  (via drill 0.3)
  Top 0.152: v26.36,31.09 24.16,33.3 23.93,33.3 23.47,32.84 U$1.P16 | v28.73,28.73 28.73,19.58 27.58,18.44 v21.26,18.44
  Bottom 0.152: v28.73,28.73 v26.36,31.09 | v21.26,18.44 12.34,9.53 5.33,9.53 JP5.2
MOSI
  Top 0.152: U$1.P17 23.09,33.22 27.05,37.19 27.05,45.8 27.36,46.1 28.8,46.1 37.19,37.72 37.19,19.43 32.84,15.09 32.84,5.64 28.19,0.99 7.32,0.99 4.27,4.04 4.27,4.88 5.26,5.87 5.26,6.93 JP5.4
N$2
  Top 0.152: R2.2 3.05,58.14 3.89,58.14 4.42,57.61 5.49,57.61 5.79,57.91 5.79,63.7 7.39,65.3 19.89,65.3 20.5,64.69 20.5,57.23 17.45,54.18 17.45,49.61 14.71,46.86 14.02,46.86 13.41,46.25 13.41,40.69 18.44,35.66 U$1.P25
N$3
  Top 0.152: LED2.A 4.95,59.82 3.05,59.82 R2.1
N$4
  Top 0.152: 11.2,14.02 11.2,15.85 | 11.2,14.02 11.05,13.87 C1.1 | C1.1 10.97,13.79 9.07,13.79 R35.P$2 9.07,13.87 9.07,15.32 D1.CATHODE | U2.P$3 12.65,12.12 12.34,12.12 11.73,12.72 11.73,12.95 10.97,13.72 C1.1 | 11.2,14.02 12.65,14.02 U2.P$1 | 11.2,14.02 C1.1
N$5
  Top 0.152: R4.2 7.92,35.89 6.63,35.89 5.18,37.34 4.34,37.34 J1.4
N$6
  Top 0.152: R7.P$1 18.06,15.32 19.96,15.32 R13.P$2
N$7
  Top 0.152: U$4.P6 16.38,46.02 16.38,46.25 19.28,49.15 19.96,49.15 R36.1
N$8
  Top 0.152: R11.2 5.03,50.83 6.93,50.83 R12.2 7.01,50.83 8.99,50.83 R24.1
N$9
  Top 0.152: R13.P$1 20.02,16.77 21.93,16.77 R14.P$2
N$10
  Top 0.152: C4.P$1 15.93,50.83 14.02,50.83 R10.2 13.95,50.83 12.12,50.83 R9.1 12.04,50.83 10.36,49.15 9.07,49.15 R24.2 8.99,49.23 8.31,49.91 4.5,49.91 3.62,50.79 | 3.62,50.79 3.58,50.83 3.05,50.83 R8.2 | 3.62,50.79 3.81,50.98 3.81,53.72 3.58,53.95 2.52,53.95 2.21,54.25 2.21,55.47 2.36,55.63 7.92,55.63 10.36,58.06 10.36,60.73 11.05,61.42 11.51,61.42 14.25,58.67 14.94,58.67 15.54,58.06 16.69,58.06 U$15.3
N$11
  Top 0.152: R14.P$1 22.02,15.32 23.93,15.32 R15.P$1 24,15.32 25.98,15.32 C8.P$1 26.06,15.24 26.06,10.67 26.9,9.83 26.9,8.76 U$5.3
N$12
  Top 0.152: LED1.A 7.01,59.82 8.99,59.82 R3.1
N$13  (via drill 0.3)
  Top 0.152: v7.01,56.16 R3.2 | v10.67,43.2 10.67,42.75 18.06,35.36 U$1.P26
  Bottom 0.152: v7.01,56.16 7.01,49.07 5.26,47.32 5.26,46.86 5.79,46.33 7.54,46.33 v10.67,43.2
N$14
  Top 0.152: L1.2 6.02,45.8 6.02,45.57 6.78,44.81 6.78,41.15 4.95,39.32 4.34,39.32 J1.1
N$15
  Top 0.254: U$14.P$2 15.62,4.28 U$9.ANODE 17.35,8 U$8.1
N$16
  Top 0.305: LD1.P$3 33.76,19.96 30.02,16.23 30.02,4.04 U1.P$3
N$17
  Top 0.305: R25.P$2 25.76,2.06 26.98,2.06 27.96,3.05 U1.P$2 28.04,3.2 28.8,3.96 28.8,8.53 26.98,10.36 26.98,11.28 U$5.4
N$18
  Top 0.152: J1.S4 4.27,34.75 1.6,34.75 J1.S2 1.6,34.82 1.6,36.73 J1.S6 1.6,39.17 J1.S5 1.6,39.24 1.6,41.22 J1.S1 1.6,41.38 2.59,42.37 3.05,42.37 3.09,42.41 | 3.09,42.41 4.27,41.22 J1.S3 | 3.09,42.41 3.05,42.44 3.05,44.2 R26.P$1
N$19
  Top 0.305: U1.P$1 27.96,4.95 25.76,4.95 R16.P$2
N$20
  Top 0.152: R16.P$1 24.31,5.03 24.31,8 24.99,8.69 U$5.1
N$24
  Top 0.152: LED3.A 7.01,63.78 8.99,63.78 R20.1
N$25
  Top 0.152: 20.8,3.12 21.95,3.12 C15.1 | 20.8,3.12 20.04,3.12 R17.1 | R18.2 10.06,9.83 13.56,9.83 14.02,9.37 16.46,9.37 16.99,9.91 17.3,9.91 U$8.3 17.37,9.91 19.58,9.91 20.8,8.69 20.8,3.12
N$26
  Top 0.152: R19.2 8,9.91 8.61,9.91 9.3,10.59 14.02,10.59 14.63,9.98 U$8.4
N$27
  Top 0.152: LED4.A 4.95,63.78 3.05,63.78 R21.1
N$28
  Top 0.152: R20.2 8.99,62.1 8.23,62.1 6.1,59.97 6.1,57.76 4.27,55.93 2.21,55.93 1.45,55.17 1.45,49.3 3.12,47.62 6.02,47.62 6.93,46.71 6.93,45.41 16.99,35.36 17.37,35.36 17.75,34.98 U$1.P27
N$29  (via drill 0.3)
  Top 0.152: v4.57,45.72 1.14,49.15 1.14,60.12 2.97,61.95 2.97,62.1 R21.2 | v7.32,42.98 8.91,42.98 17.37,34.52 U$1.P28
  Bottom 0.152: v7.32,42.98 v4.57,45.72
N$30
  Top 0.152: R30.2 22.02,54.86 23.93,54.86 R33.2 24.08,54.86 25.98,54.86 R34.1
N$31
  Top 0.152: R6.2 5.03,54.86 6.93,54.86 R31.2 7.01,54.86 8.99,54.86 R32.1
N$32
  Top 0.152: U$16.3 21.72,57.99 20.04,56.31 20.04,54.86 R27.2 20.12,54.86 20.57,54.86 21.49,53.95 25.22,53.95 25.98,53.19 R34.2 26.06,53.19 27.36,53.19 28.96,54.79 R28.1 29.03,54.86 30.94,54.86 R29.2 31.01,54.79 32.99,54.79 C5.P$1
N$35
  Top 0.152: R39.2 22.02,50.83 23.93,50.83 R40.2 24,50.83 25.98,50.83 R41.1
N$36  (via drill 0.3)
  Top 0.152: C6.P$1 32.99,50.83 31.01,50.83 R38.2 30.94,50.83 29.03,50.83 R37.1 | R37.1 28.96,50.83 27.36,49.23 26.06,49.23 R41.2 25.98,49.23 25.3,49.91 21.57,49.91 20.65,50.83 20.04,50.83 R36.2 | v28.12,56.31 26.75,57.68 26.75,57.99 U$17.3 | v28.12,52.27 28.12,51.74 28.96,50.9 R37.1
  Bottom 0.152: v28.12,52.27 v28.12,56.31
NRST
  Top 0.152: U$1.P7 22.71,27.89 22.55,27.89 20.42,30.02 17.3,30.02 16.76,30.56 14.94,30.56 11.2,26.82 11.2,26.67 10.9,26.36 2.67,26.36 1.68,25.38 1.68,24.61 2.29,24 4.27,24 5.26,24.99 JP1.4
OUT
  Top 0.152: U$7.1 11.73,59.89 12.42,59.89 14.25,58.06 U$7.4 14.33,57.99 15.16,57.99 15.62,57.53 20.04,57.53 20.19,57.68 20.19,61.04 19.51,61.72 JP3.1
OUT1
  Top 0.152: 17.49,59.85 19.28,58.06 U$15.4 | 17.49,59.85 17.45,59.89 16.76,59.89 U$15.1 | 17.49,59.85 17.53,59.89 17.53,62.33 19.43,64.24 JP3.2
OUT2
  Top 0.152: JP3.3 21.95,61.72 21.72,61.49 21.72,59.97 U$16.1 21.79,59.97 22.33,59.97 24.23,58.06 U$16.4
OUT3
  Top 0.152: U$17.4 29.26,58.06 27.43,59.89 26.75,59.89 U$17.1 26.67,59.97 26.67,61.04 24.46,63.25 23.01,63.25 22.02,64.24 JP3.4
SCK  (via drill 0.3)
  Top 0.152: v22.17,30.86 U$1.P15
  Bottom 0.152: 22.17,24.99 22.17,25.3 | 22.17,25.3 v22.17,30.86 | 22.17,25.3 19.89,25.3 7.62,13.03 7.62,12.42 6.17,10.97 6.17,10.82 5.94,10.59 4.88,10.59 4.27,9.98 4.27,9.07 4.5,8.84 4.5,8.76 2.74,7.01 JP5.3
SCL  (via drill 0.3)
  Top 0.152: v18.75,28.5 21.26,28.5 22.17,27.58 22.33,27.58 U$1.P6
  Bottom 0.152: v18.75,28.5 18.75,28.19 18.67,28.12 18.67,27.89 6.86,16.08 6.33,16.08 5.26,15.01 JP6.4
SDA  (via drill 0.3)
  Top 0.152: v17.45,28.35 17.83,27.96 21.18,27.96 21.95,27.2 U$1.P5
  Bottom 0.152: v17.45,28.35 6.63,17.53 5.33,17.53 JP6.2
SPI_CS  (via drill 0.3)
  Top 0.152: v22.17,31.62 22.17,32.84 22.71,33.38 22.71,33.53 U$1.P18
  Bottom 0.152: v22.17,31.62 22.71,31.09 22.71,30.18 22.48,29.95 22.48,24.84 22.63,24.69 21.95,24 21.79,24 21.72,24.08 20.88,24.08 16.61,19.81 16.61,18.9 17.3,18.21 18.21,18.21 18.97,18.97 21.49,18.97 21.79,18.67 21.79,18.21 6.33,2.74 4.42,2.74 2.74,4.42 JP5.5
SWCLK
  Top 0.152: U$1.P37 14.55,29.57 11.05,26.06 3.73,26.06 2.74,25.07 JP1.3
SWDIO  (via drill 0.3)
  Top 0.152: v10.67,26.9 14.63,30.86 14.94,30.86 15.77,31.7 15.77,31.85 15.32,32.31 15.32,32.46 U$1.P34
  Bottom 0.152: v10.67,26.9 10.67,25.45 6.02,20.8 4.42,20.8 2.74,22.48 JP1.5
USB_DM
  Top 0.254: J1.2 10.35,38.65 10.62,38.38 10.62,37.02 U$12.P1 12.18,37 U$1.P32
USB_DP
  Top 0.254: J1.3 8.35,38 U$12.P3 9.35,36.65 10,36 12.47,36 U$1.P33
VUSB  (via drill 0.3)
  Top 0.254: U$14.P$1 12.38,7.38 13,8 14.65,8 U$8.5
  Top 0.305: C20.P$1 15.93,62.26 13.03,62.26 C19.P$1 12.88,62.18 12.34,61.65 v12.04,61.65 | v11.28,60.88 10.74,60.35 10.74,59.59 11.28,59.05 11.66,59.05 U$7.2 | v14.48,59.21 14.63,59.05 16.69,59.05 U$15.2 | v22.78,58.75 22.55,58.98 21.72,58.98 U$16.2 | U$10.CATHODE 35.59,62.94 30.1,57.45 28.57,57.45 28.35,57.68 28.35,57.76 27.13,58.98 26.75,58.98 U$17.2 26.59,59.05 v25.53,59.05 | v5.79,47.09 5.41,46.71 5.33,46.71 5.18,46.56 5.18,45.03 5.94,44.27 L1.1 5.94,44.04 5.94,40.92 5.11,40.08 3.73,40.08 3.28,39.62 3.28,36.35 3.5,36.12 4.95,36.12 5.33,35.74 5.33,33.91 4.88,33.45 4.88,30.02 | C18.P$1 10.06,2.29 10.59,2.29 12.27,3.96 U$14.P$1 | C17.P$1 9.98,5.26 C9.P$1 8,5.41 8,5.56 7.24,6.33 7.24,7.32 | 7.24,7.32 7.92,8 R19.1 8.15,8.15 8.99,8.99 10.67,8.99 12.27,7.39 12.38,7.38 | v13.18,26.14 9.07,22.02 9.07,18.75 D1.ANODE | 3.28,30.02 4.88,30.02 | 4.88,30.02 5.56,30.02 | 5.56,30.02 6.17,30.02 9.98,33.83 9.98,34.98 U$12.P5 | 3.28,30.02 2.36,30.94 U$13.CATHODE | 3.28,30.02 0.99,27.74 0.99,9.75 2.29,8.46 5.33,8.46 6.4,7.39 7.16,7.39 7.24,7.32 | 5.56,30.02 v5.56,29.57
  Bottom 0.305: v11.28,60.88 v12.04,61.65 v14.48,59.21 15.09,58.6 | 15.09,58.6 22.63,58.6 v22.78,58.75 22.86,58.83 25.3,58.83 v25.53,59.05 | v5.79,47.09 15.01,56.31 15.01,58.52 15.09,58.6 | v13.18,26.14 10.9,28.42 6.71,28.42 | 6.71,28.42 5.87,27.58 5.33,27.58 JP1.2 | v5.56,29.57 6.71,28.42
XCOARSE_IN  (via drill 0.3)
  Top 0.152: v7.47,45.64 9.07,44.04 9.3,44.04 U$2.P1 | v1.98,49.68 1.98,52.12 2.97,53.11 R5.1 | v15.77,30.02 15.7,30.02 15.01,29.34 U$1.P38
  Bottom 0.152: v1.98,49.68 5.64,46.02 7.09,46.02 v7.47,45.64 15.77,37.34 v15.77,30.02
XFINE_IN  (via drill 0.3)
  Top 0.152: v12.88,46.33 12.88,46.25 10.67,44.04 U$2.P3 | v10.13,49.68 10.13,51.13 8.91,52.35 7.77,52.35 7.01,53.11 R31.1 6.93,53.19 5.03,53.19 R6.1 | v16.54,30.02 15.47,28.96 15.32,28.96 U$1.P39
  Bottom 0.152: v10.13,49.68 12.88,46.94 v12.88,46.33 14.71,46.33 15.09,45.95 15.09,44.35 16.54,42.9 v16.54,30.02
XSUM
  Top 0.152: C7.P$1 15.93,54.79 14.02,54.79 R23.2 | U$7.3 11.73,57.99 11.73,57.07 13.95,54.86 R23.2 | R5.2 3.05,54.79 3.66,54.79 4.5,53.95 8.23,53.95 8.99,53.19 R32.2 9.07,53.19 11.96,53.19 R22.1 11.96,53.26 13.72,55.02 R23.2
YCOARSE_IN
  Top 0.152: U$1.P21 21.64,34.52 21.26,34.14 20.42,34.14 19.51,35.05 19.51,35.2 16.38,38.33 16.38,43.97 U$4.P1 16.31,44.04 15.01,44.04 13.72,45.34 13.72,46.1 14.17,46.56 14.86,46.56 17.75,49.45 17.75,50.44 19.96,52.65 19.96,53.11 R27.1
YFINE_IN
  Top 0.152: R33.1 23.93,53.19 22.02,53.19 R30.1 21.95,53.11 21.34,53.11 19.81,51.59 19.36,51.59 18.06,50.29 18.06,49.3 15.01,46.25 14.33,46.25 14.02,45.95 14.02,45.49 14.94,44.58 17.3,44.58 17.6,44.27 17.6,44.04 U$4.P3 17.68,43.97 17.68,37.49 19.81,35.36 19.81,35.2 20.5,34.52 20.88,34.52 21.26,34.9 U$1.P22

### Text on the board
Bottom: Peachy v1.13 / Bottom Side